# EAGLE design ASTABLE 555 timer (EAGLE 9.6.2)
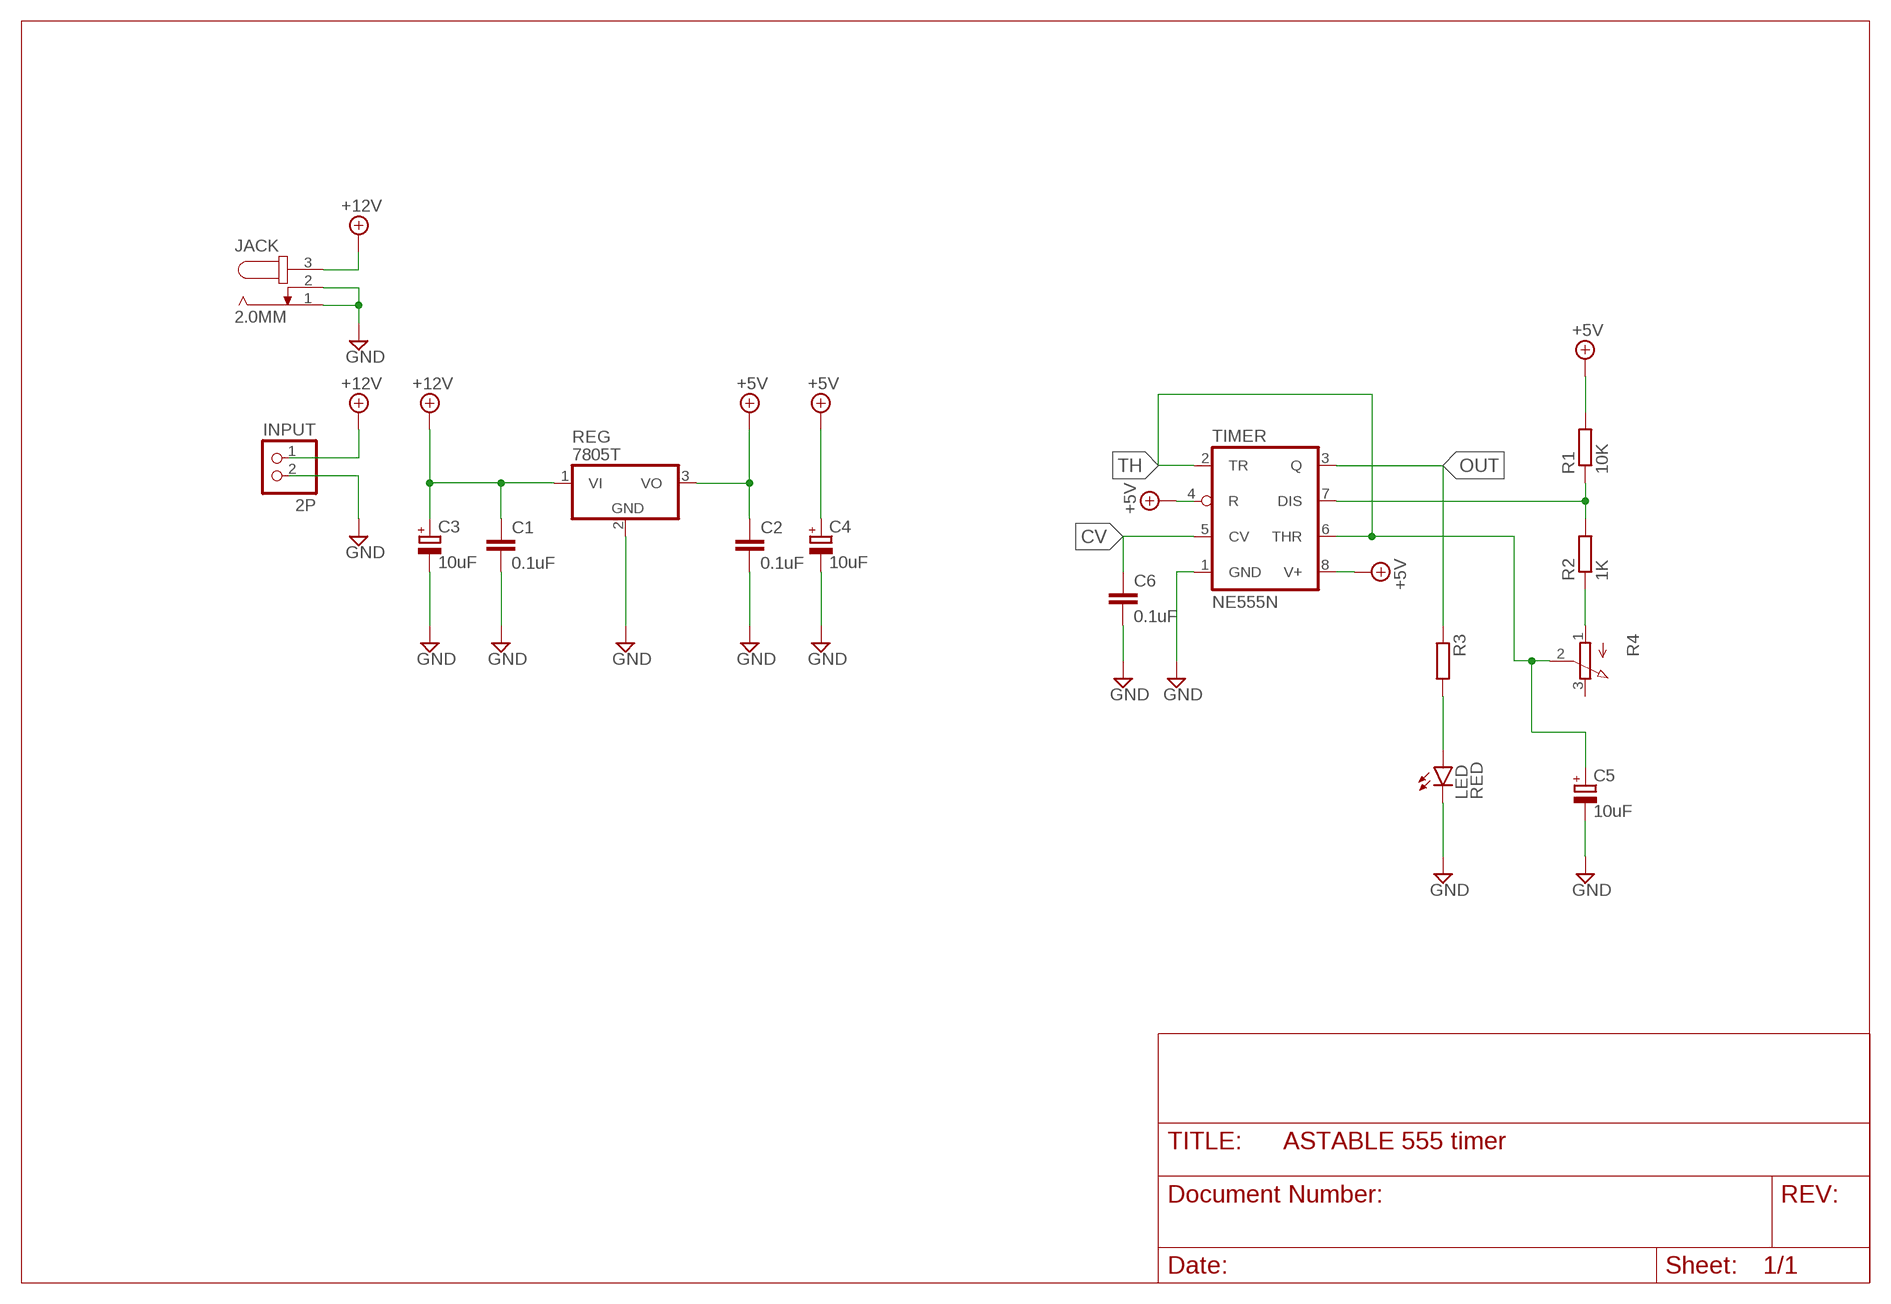
[diagram p0: schematic, sheet 1]

## Parts
C1  0.1uF  C-EU050-030X075  [C050-030X075]
C2  0.1uF  C-EU050-030X075  [C050-030X075]
C3  10uF  CPOL-EUE3.5-8  [E3,5-8]
C4  10uF  CPOL-EUE3.5-8  [E3,5-8]
C5  10uF  CPOL-EUE3.5-8  [E3,5-8]
C6  0.1uF  C-EU050-030X075  [C050-030X075]
INPUT  2P  PINHD-1X2  [1X02]
JACK  2.0MM  JACK-PLUG1  [SPC4078]
LED  RED  LED5MM  [LED5MM]
R1  10K  R-EU_0207/10  [0207/10]
R2  1K  R-EU_0207/10  [0207/10]
R3  R-EU_0207/10  [0207/10]
R4  3RP/1610N  [3RP/1610N]
REG  7805T  [TO220H]
TIMER  NE555N  [DIL08]

## Nets
+5V [POWER]: C2.1 C4.+ R1.2 REG.3(VO) TIMER.4(R) TIMER.8(V+)
+12V [POWER]: C1.1 C3.+ INPUT.1 JACK.3 REG.1(VI)
CV: C6.1 TIMER.5(CV)
GND [POWER]: C1.2 C2.2 C3.- C4.- C5.- C6.2 INPUT.2 JACK.1 JACK.2 LED.K(C) REG.2(GND) TIMER.1(GND)
N$2: R1.1 R2.2 TIMER.7(DIS)
N$4: R2.1 R4.1(A)
N$6: LED.A R3.2
OUT: R3.1 TIMER.3(Q)
TH: C5.+ R4.2(S) TIMER.2(TR) TIMER.6(THR)
Unconnected: R4.3(E)

## Library data of the parts
C1 C2 C6 = rcl:C-EU: CAPACITOR, European symbol; SPICEPREFIX: C
C3-C5 = rcl:CPOL-EU: POLARIZED CAPACITOR, European symbol; SPICEPREFIX: C
INPUT = pinhead:PINHD-1X2: PIN HEADER
JACK = con-jack:JACK-PLUG: DC POWER JACK Power Jack, DC, Right Angle, Through Hole, Rated 5A at 16VDC, PC Terminals Distributor: Farnell (www.Farnell.de) Drawing: 84N1161.pdf / 84N1162.pdf Manufacturer: SPC Technology (www.spctechnology.com) Type: SPC4077 / SPC 4078; OC_FARNELL: unknown; OC_NEWARK: unknown
LED = led:LED: LED OSRAM: - CHIPLED LG R971, LG N971, LY N971, LG Q971, LY Q971, LO R971, LY R971 LH N974, LH R974 LS Q976, LO Q976, LY Q976 LO Q996 - Hyper CHIPLED LW Q18S LB Q993, LB Q99A, LB R99A - SideLED LS A670, LO A670, LY A670, LG A670, LP A670 LB A673, LV A673, LT A673, LW A673 LH A674 LY A675 LS A676, LA A676, LO A676, LY A676, LW A676 LS A679, LY A679, LG A679 - Hyper Micro SIDELED® LS Y876, LA Y876, LO Y876, LY Y876 LT Y87S - SmartLED LW L88C, LW L88S LB L89C, LB L89S, LG L890 LS L89K, LO L89K, LY L89K LS L896, LA L896, LO L896, LY L896 - TOPLED LS T670, LO T670, LY T670, LG T670, LP T670 LSG T670, LSP T670, LSY T670, LOP T670, LYG T670 LG T671, LOG T671, LSG T671 LB T673, LV T673, LT T673, LW T673 LH T674 LS T676, LA T676, LO T676, LY T676, LB T676, LH T676, LSB T676, LW T676 LB T67C, LV T67C, LT T67C, LS T67K, LO T67K, LY T67K, LW E67C LS E67B, LA E67B, LO E67B, LY E67B, LB E67C, LV E67C, LT E67C LW T67C LS T679, LY T679, LG T679 LS T770, LO T770, LY T770, LG T770, LP T770 LB T773, LV T773, LT T773, LW T773 LH T774 LS E675, LA E675, LY E675, LS T675 LS T776, LA T776, LO T776, LY T776, LB T776 LHGB T686 LT T68C, LB T68C - Hyper Mini TOPLED® LB M676 - Mini TOPLED Santana® LG M470 LS M47K, LO M47K, LY M47K Source: http://www.osram.convergy.de LUXEON: - LUMILED® LXK2-PW12-R00, LXK2-PW12-S00, LXK2-PW14-U00, LXK2-PW14-V00 LXK2-PM12-R00, LXK2-PM12-S00, LXK2-PM14-U00 LXK2-PE12-Q00, LXK2-PE12-R00, LXK2-PE12-S00, LXK2-PE14-T00, LXK2-PE14-U00 LXK2-PB12-K00, LXK2-PB12-L00, LXK2-PB12-M00, LXK2-PB14-N00, LXK2-PB14-P00, LXK2-PB14-Q00 LXK2-PR12-L00, LXK2-PR12-M00, LXK2-PR14-Q00, LXK2-PR14-R00 LXK2-PD12-Q00, LXK2-PD12-R00, LXK2-PD12-S00 LXK2-PH12-R00, LXK2-PH12-S00 LXK2-PL12-P00, LXK2-PL12-Q00, LXK2-PL12-R00 Source: www.luxeon.com KINGBRIGHT: KA-3528ASYC Source: www.kingbright.com
R1-R3 = rcl:R-EU_: RESISTOR, European symbol; SPICEPREFIX: R
R4 = pot:3RP/1610N: 16mm Potentiometer one level Source: http://www.alphapotentiometers.net/html/16mm_pot_2.html
REG = linear:78*: Positive VOLTAGE REGULATOR Source: http://cache.national.com/ds/LM/LM78L05.pdf http://www.fairchildsemi.com/ds/LM/LM7805.pdf
TIMER = linear:*555: TIMER

## Net classes
0 default: width 0.305 mm, drill 0.305 mm, clearance 0.254 mm
1 POWER: width 0.406 mm, drill 0.406 mm, clearance 0.305 mm

## Board
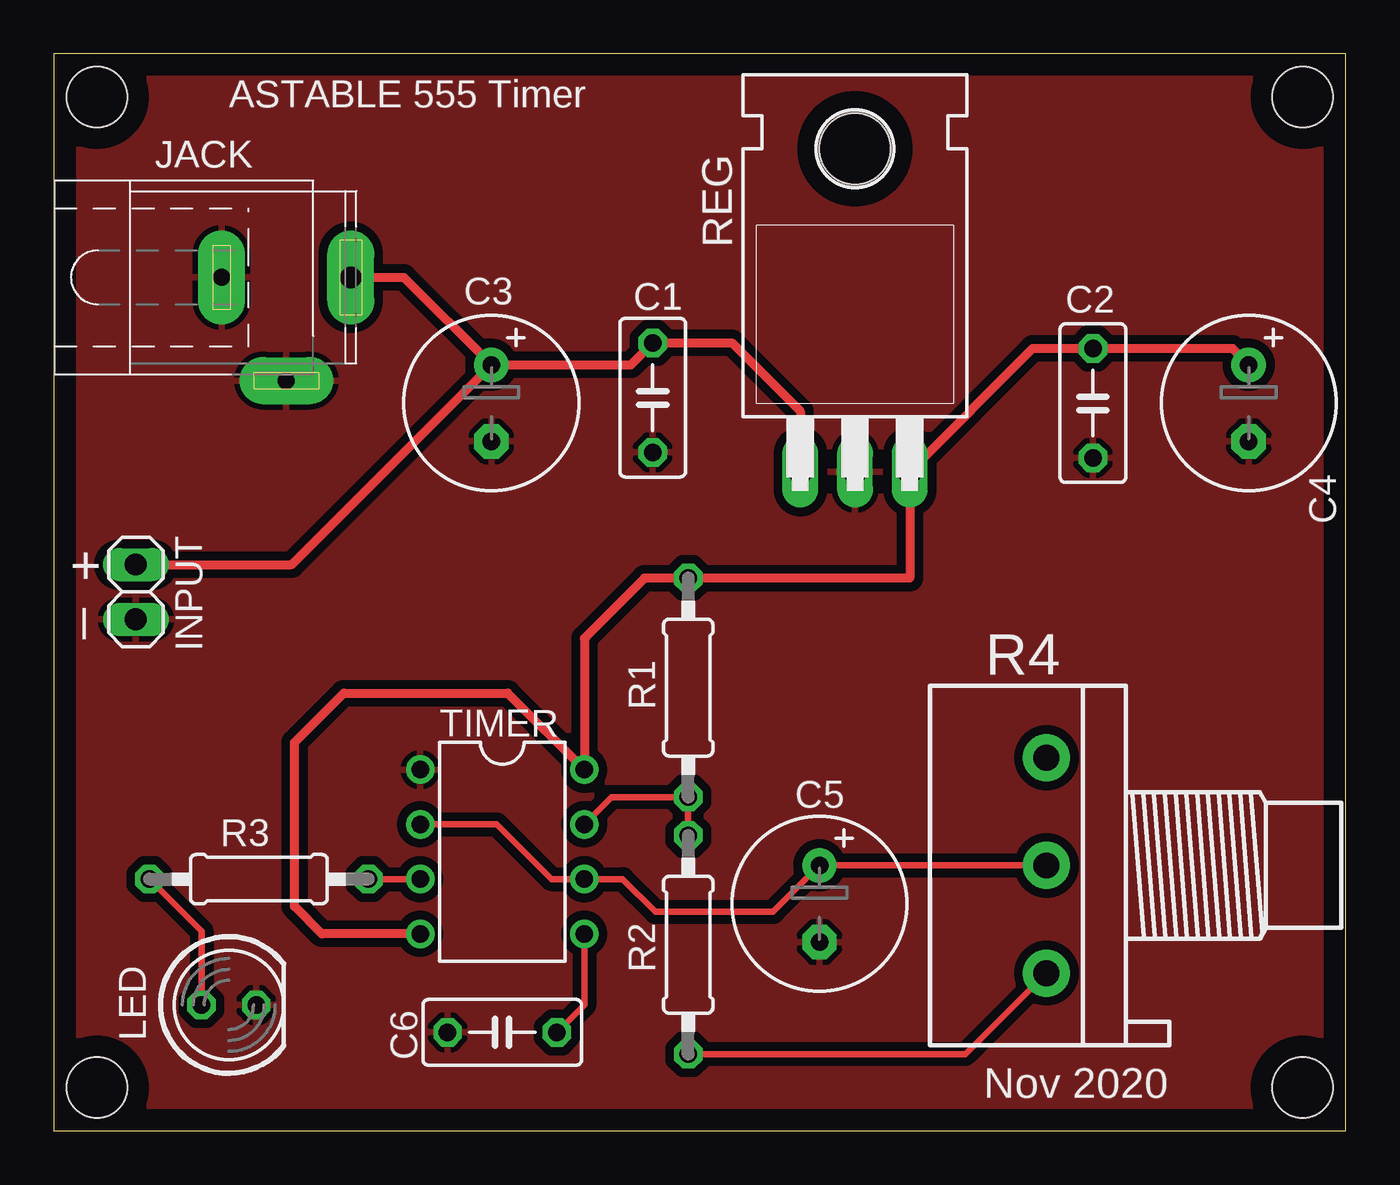
[diagram p1: board, top side]

Size 60 x 50 mm. Coordinates in mm from the lower left corner, seen from the top.
Outline: 0,0 60,0 60,50 0,50 0,0
Copper layers (1*16): Top 0.035mm / dielectric 1.5mm / Bottom 0.035mm
Design rules "default": minimum track width 6mil, minimum drill 0.35mm, track to track 6mil, track to pad 6mil, pad to pad 6mil, via to via 6mil, smd to smd 6mil, copper to edge 40mil, drill to drill 6mil, minimum pad ring 10mil, minimum via ring 8mil, stop-mask expansion 4mil, vias tented up to drill 0mil, thermal gap 10mil
Holes 2.8 mm at 2,48 58,48 2,2 58,2

### Footprints (pad centres in the part's own frame; a part is rotated, then mirrored left to right if it is on the bottom)
C050-030X075 = drill 0.813 octagon: 1 -2.54,0; 2 2.54,0
E3,5-8 = drill 0.813 pad 1.6: + -1.778,0 | drill 0.813 pad 1.6 octagon: - 1.778,0
1X02 = drill 1.016 long: 1 -1.27,0; 2 1.27,0
SPC4078 = drill 0.8 pad 2.184 long: 1 -3,0; 2 0,-4.8 | drill 1 pad 2.184 long: 3 3,0
LED5MM = drill 0.813 octagon: A -1.27,0; K 1.27,0
0207/10 = drill 0.813 octagon: 1 -5.08,0; 2 5.08,0
3RP/1610N = drill 1.2 pad 2.184: 1 -5,0; 2 0,0; 3 5,0
TO220H = drill 1.118 long: 1 -2.54,-10.16; 2 0,-10.16; 3 2.54,-10.16 | hole 3.302: 0,4.826
DIL08 = drill 0.813 pad 1.27: 1 -3.81,-3.81; 2 -1.27,-3.81; 3 1.27,-3.81; 4 3.81,-3.81; 5 3.81,3.81; 6 1.27,3.81; 7 -1.27,3.81; 8 -3.81,3.81

### Placement (x,y rotation side)
C1  27.81,34.04 270 top
C2  48.26,33.78 270 top
C3  20.32,33.78 270 top
C4  55.5,33.78 270 top
C5  35.56,10.54 270 top
C6  20.83,4.57 180 top
INPUT  3.81,25.02 270 top
JACK  10.79,39.62 0 top
LED  8.13,5.84 0 top
R1  29.46,20.57 90 top
R2  29.46,8.64 90 top
R3  9.53,11.68 180 top
R4  46.1,12.32 90 top
REG  37.21,40.77 0 top
TIMER  20.83,12.95 270 top

### Tracks (layer width: path | path; a pad name or v marks a point on that pad's centre or on a via)
+5V
  Top 0.406: C4.+ 54.74,36.32 C2.1 45.47,36.32 REG.3 39.75,25.65 R1.2 27.43,25.65 24.64,22.86 TIMER.8 21.08,20.32 13.46,20.32 11.18,18.03 11.18,10.41 12.45,9.14 TIMER.4
+12V
  Top 0.406: JACK.3 16.26,39.62 C3.+ | C3.+ 26.8,35.56 C1.1 31.5,36.58 34.67,33.4 REG.1 | INPUT.1 11.05,26.29 C3.+
CV
  Top 0.305: TIMER.5 24.64,5.84 C6.1
GND
  pour Top (isolate 0.406): 0.25,49.78 59.69,49.78 59.69,0.25 0.25,0.25
N$2
  Top 0.305: TIMER.7 25.91,15.49 R1.1 R2.2
N$4
  Top 0.305: R4.1 42.34,3.56 R2.1
N$6
  Top 0.305: R3.2 6.86,9.27 LED.A
OUT
  Top 0.305: R3.1 TIMER.3
TH
  Top 0.305: TIMER.2 20.57,14.22 23.11,11.68 TIMER.6 26.42,11.68 27.94,10.16 33.4,10.16 C5.+ R4.2

### Text on the board
tNames: ASTABLE 555 Timer | + | _ | Nov 2020